# Altium schematic sheet 变送器.SchDoc
size A4
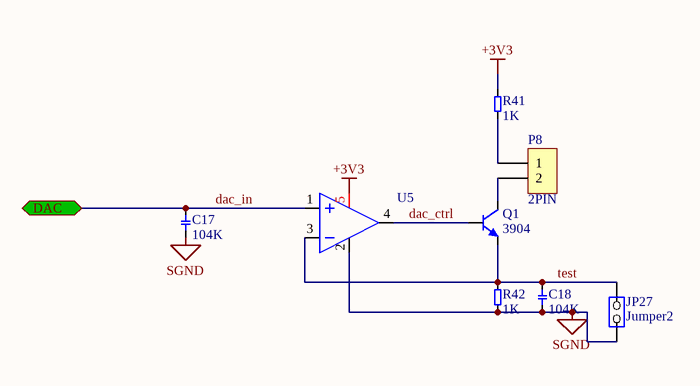
[diagram p0: 变送器.SchDoc]

## Parts
C17  104K  [0603]
C18  104K  [0603]
JP27  Jumper2  [CON2-P2.54]
P8  2PIN  [CON2-P2.54]
Q1  3904  [SOT-23-3L]
R41  1K  [1206]
R42  1K  [1206]
U5  LM321  [SOT-23-5L]  (value not drawn)

## Ports
DAC

## Nets
+3V3: R41.2 U5.5(V+)
SGND: C17.1 C18.1 JP27.2(NO) R42.1 U5.2(V-)
dac_ctrl: Q1.1(B) U5.4(OUT1)
dac_in: C17.2 U5.1(IN1+) ; port DAC
test: C18.2 JP27.1(COMMON) Q1.2(E) R42.2 U5.3(IN1-)
NetP8_1: P8.1 R41.1
NetP8_2: P8.2 Q1.3(C)

## Library data of the parts
C17 C18 = Cap: 电容; Specifications: 16V,±10%; Published: 8-Jun-2000; LatestRevisionDate: 17-Jul-2002; LatestRevisionNote: Re-released for DXP Platform.; PackageReference: RAD-0.3; Publisher: Altium Limited; Value: 104K
P8 = Header 2: 连接器; specification: pitch3.96mm VH; LatestRevisionDate: 17-Jul-2002; LatestRevisionNote: Re-released for DXP Platform.; Publisher: Altium Limited; Value: 2PIN
Q1 = transistor NPN: 三极管; Published: 8-Jun-2000; LatestRevisionDate: 17-Jul-2002; LatestRevisionNote: Re-released for DXP Platform.; PackageReference: TO-226; Publisher: Altium Limited; Code_JEDEC: TO-226-AA; Value: 3904
R41 R42 = Res1: 电阻; Specifications: ±1%; Published: 8-Jun-2000; LatestRevisionDate: 17-Jul-2002; LatestRevisionNote: Re-released for DXP Platform.; PackageReference: AXIAL-0.3; Publisher: Altium Limited; Value: 1K
U5 = LM321: 运放; Value: LM321; specifications: LM321